# EasyEDA schematic SCH_CarAccessoryKitV1.0.json
TITLE: Car Accessory Kit; REV: 1.0; Date: 2024-07-22; Sheet: 1/1; Drawn By: williammarktaylor; Company: WMTaylor
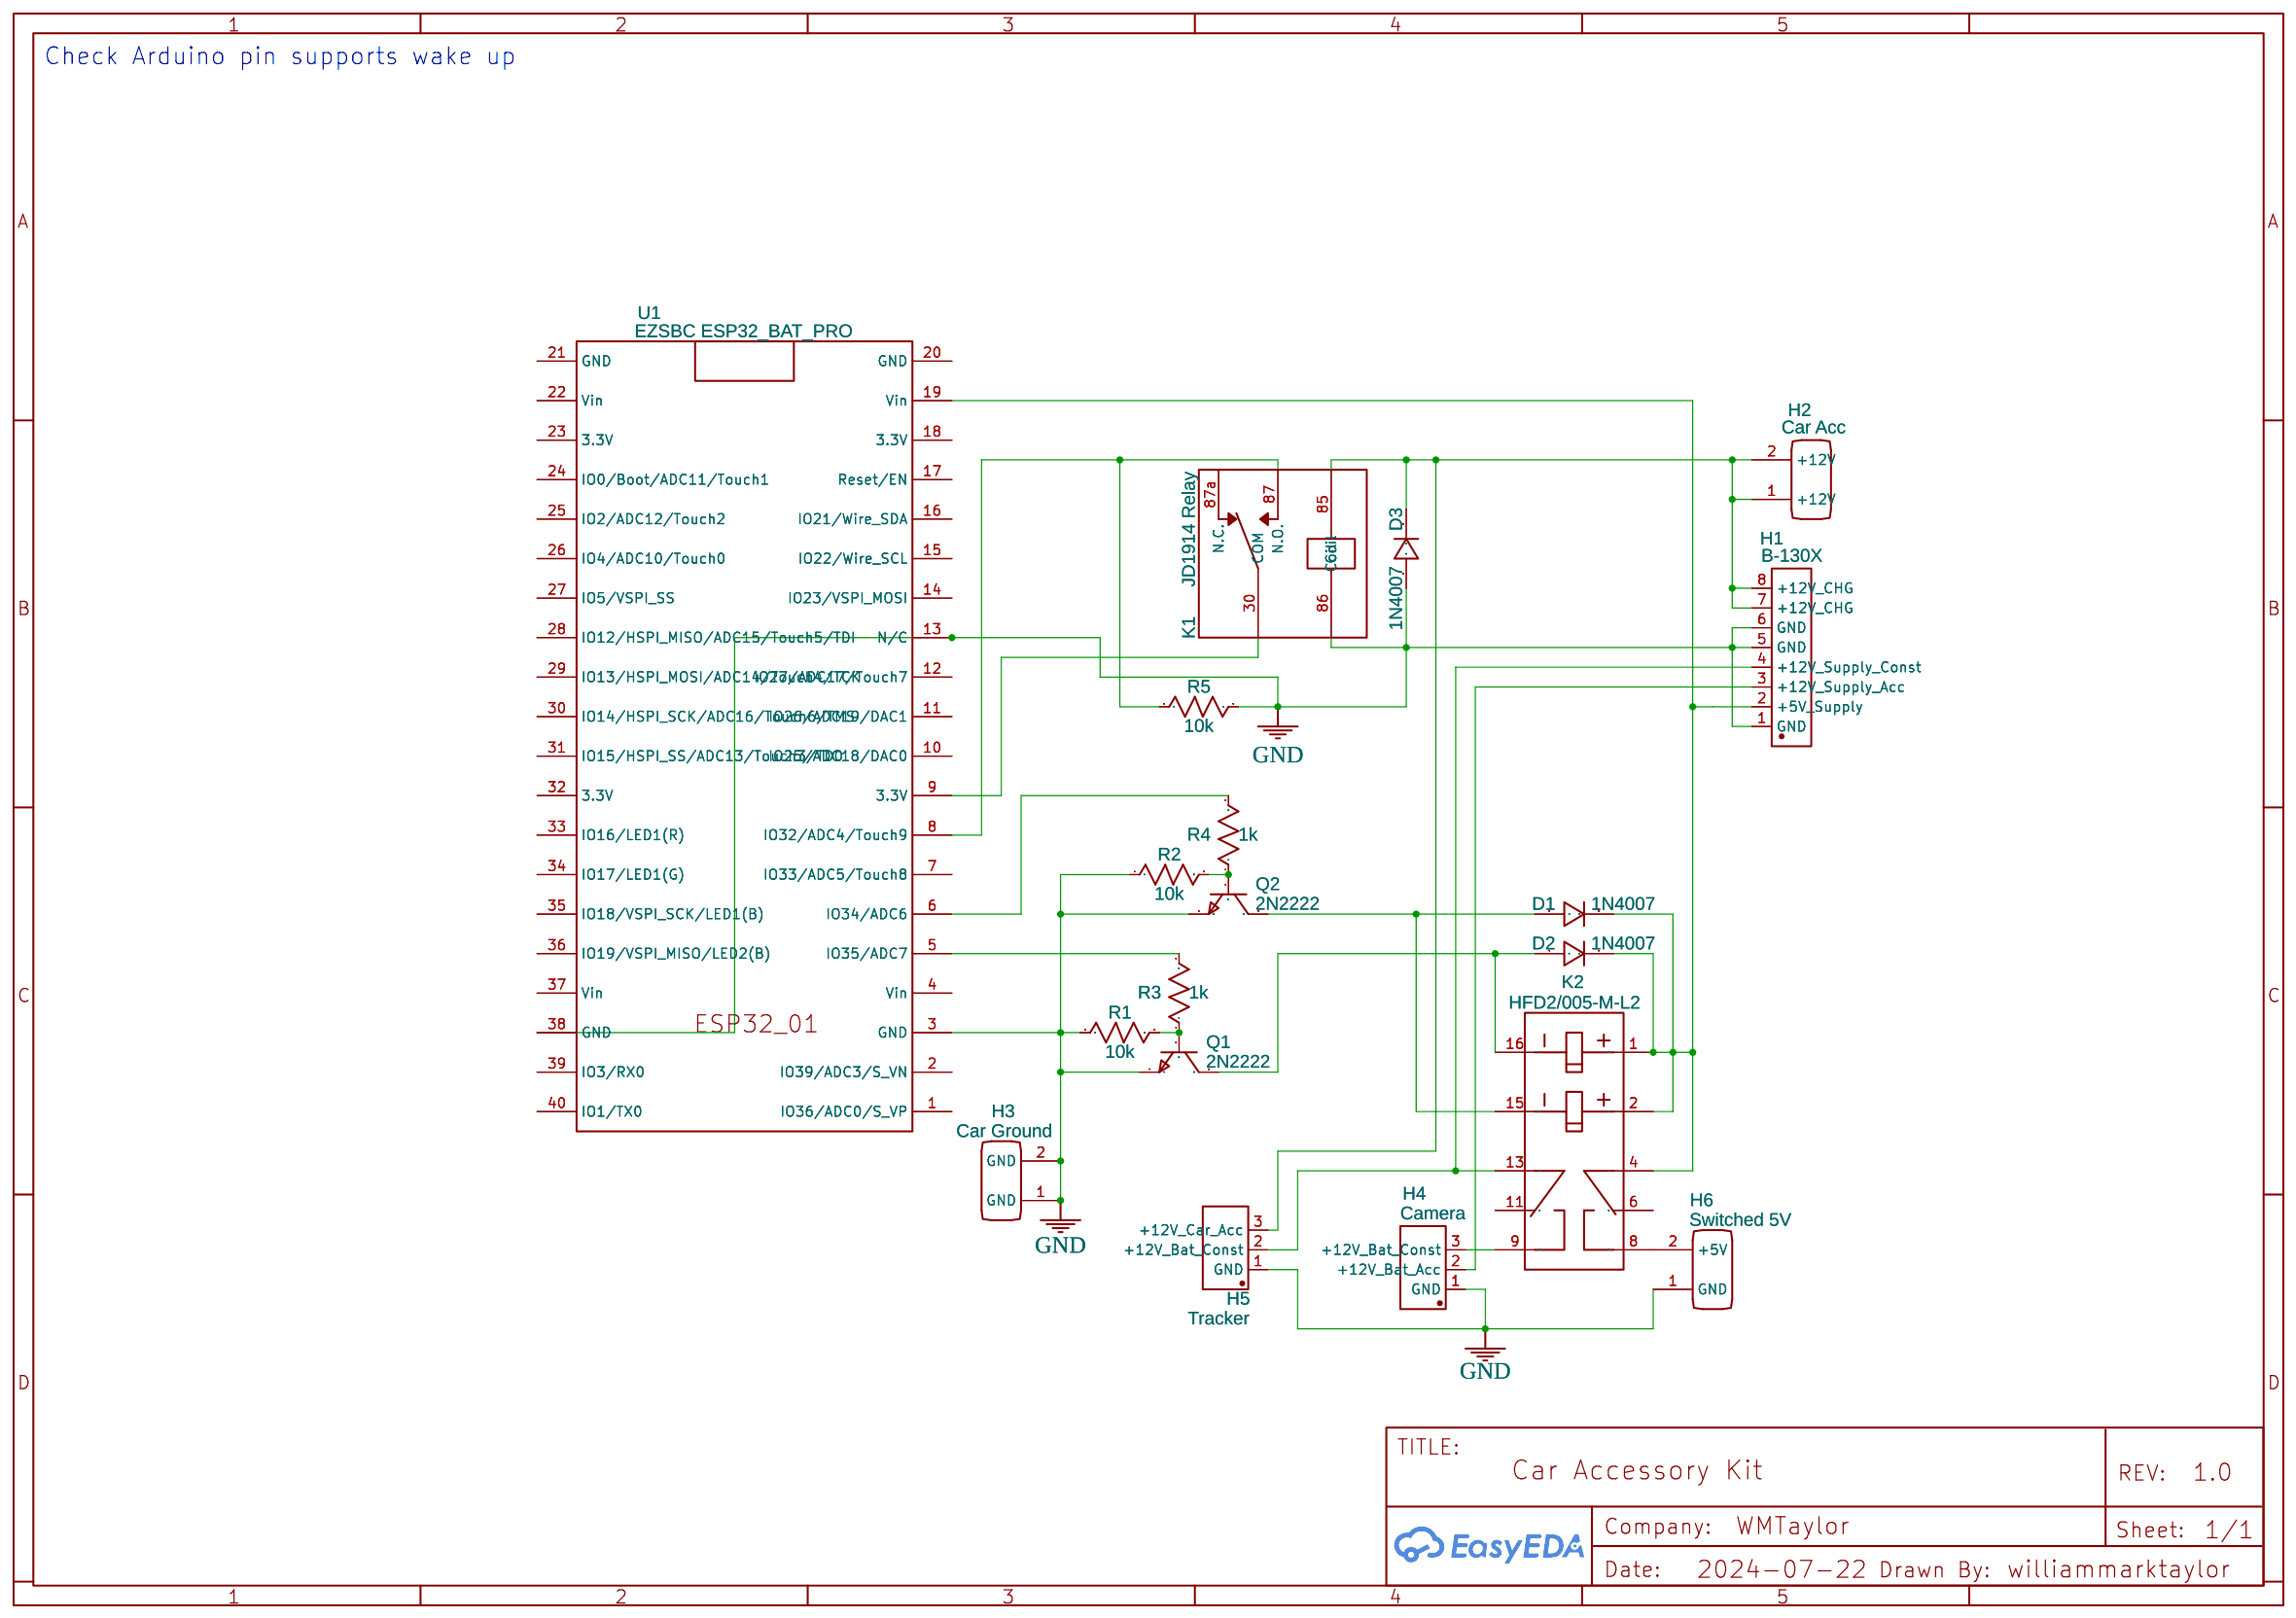
[diagram p0: schematic sheet]

## Parts
D1  1N4007  [DO-41_BD2.4-L4.7-P8.70-D0.9-RD]
D2  1N4007  [DO-41_BD2.4-L4.7-P8.70-D0.9-RD]
D3  1N4007  [DO-41_BD2.4-L4.7-P8.70-D0.9-RD]
H1  B-130X  [CONN-TH_8P-P3.96_CH3.96-8A]
H2  Car Acc  [JST_VH-2P-3.96]
H3  Car Ground  [JST_VH-2P-3.96]
H4  Camera  [CONN-TH_3P-P3.96_VH3.96-3A]
H5  Tracker  [CONN-TH_3P-P3.96_VH3.96-3A]
H6  Switched 5V  [JST_VH-2P-3.96]
K1  JD1914 Relay  [JD1914]
K2  HFD2/005-M-L2  [RELAY-TH_HFD2-X-X-L2-X]
Q1  2N2222  [2N2222]
Q2  2N2222  [2N2222]
R1  10k  [R_AXIAL-0.3]
R2  10k  [R_AXIAL-0.3]
R3  1k  [R_AXIAL-0.3]
R4  1k  [R_AXIAL-0.3]
R5  10k  [R_AXIAL-0.3]
U1  EZSBC ESP32_BAT_PRO  [EZSBC ESP32_01]

## Library data of the parts
D1-D3 = 1N4007: Supplier: LCSC; Manufacturer: SEMTECH; Supplier Part: C106903; Contributor: LCEDA_Lib
H1 = CH3.96-8A: Supplier: LCSC; Manufacturer: BOOMELE; Supplier Part: C10383; JLCPCB Part Class: Extended Part
H2 H3 H6 = JST_VH-2P-3.96: Supplier: LOCAL; Contributor: sanariyarajesh1981
H4 H5 = VH3.96-3A: Supplier: LCSC; Manufacturer: BOOMELE(博穆精密); Manufacturer Part: VH-3A; Supplier Part: C20547; JLCPCB Part Class: Extended Part
K1 = RELAY JD1914 12V 80A: Manufacturer: BenFeng; Supplier: Aliexpress; link: http://www.msrelay.com/Auto_Relay/118.html; Contributor: thien1900
K2 = HFD2/005-M-L2: Contributor: williammarktaylor; Supplier: LCSC; Supplier Part: C399485; Manufacturer: HF(宏发); JLCPCB Part Class: Extended Part
Q1 Q2 = 2N2222: Supplier: ALIEXPRESS; Contributor: BenjaminL
R1-R5 = R_AXIAL-0.3_US: Contributor: LCEDA_Lib
U1 = EZSBC ESP32_01: Manufacturer: EZSBC; Manufacturer Part: ESP32_01; Supplier Part: ESP32_01; Contributor: brad.lotsberg

## Nets
GND: D3.2 H1.1(GND) H1.5(GND) H1.6(GND) H3.1(GND) H3.2(GND) H4.1(GND) H5.1(GND) H6.1(GND) K1.86(Coil) Q1.1(E) Q2.1(E) R1.1 R2.1 R5.2 U1.3(GND) U1.13(N/C) U1.38(GND)
Net-(D1-1): D1.1 D2.1 H1.2(+5V Supply) K2.1 K2.2 K2.4 U1.19(Vin)
Net-(D1-2): D1.2 K2.15 Q2.3(C)
Net-(D2-2): D2.2 K2.16 Q1.3(C)
Net-(D3-1): D3.1 H1.7(+12V CHG) H1.8(+12V CHG) H2.1(+12V) H2.2(+12V) H5.3(+12V Car Acc) K1.85(Coil)
Net-(H1-3): H1.3(+12V Supply Acc) H4.2(+12V Bat Acc)
Net-(H1-4): H1.4(+12V Supply Const) H5.2(+12V Bat Const) K2.13
Net-(H4-3): H4.3(+12V Bat Const) K2.9
Net-(H6-2): H6.2(+5V) K2.8
Net-(K1-30): K1.30(COM) U1.9(3.3V)
Net-(K1-87): K1.87(N.O.) R5.1 U1.8(IO32/ADC4/Touch9)
Net-(Q1-2): Q1.2(B) R1.2 R3.1
Net-(Q2-2): Q2.2(B) R2.2 R4.1
Net-(R3-2): R3.2 U1.5(IO35/ADC7)
Net-(R4-2): R4.2 U1.6(IO34/ADC6)

Not connected (* = marked no-connect by the designer): K1 87a(N.C.); K2 6 11; U1 1(IO36/ADC0/S_VP) 2(IO39/ADC3/S_VN) 4(Vin) 7(IO33/ADC5/Touch8) 10(IO25/ADC18/DAC0) 11(IO26/ADC19/DAC1) 12(IO27/ADC17/Touch7) 14(IO23/VSPI MOSI) 15(IO22/Wire SCL) 16(IO21/Wire SDA) 17(Reset/EN) 18(3.3V) 20(GND) 21(GND) 22(Vin) 23(3.3V) 24(IO0/Boot/ADC11/Touch1) 25(IO2/ADC12/Touch2) 26(IO4/ADC10/Touch0) 27(IO5/VSPI SS) 28(IO12/HSPI MISO/ADC15/Touch5/TDI) 29(IO13/HSPI MOSI/ADC14/Touch4/TCK) 30(IO14/HSPI SCK/ADC16/Touch6/TMS) 31(IO15/HSPI SS/ADC13/Touch3/TD0) 32(3.3V) 33(IO16/LED1(R)) 34(IO17/LED1(G)) 35(IO18/VSPI SCK/LED1(B)) 36(IO19/VSPI MISO/LED2(B)) 37(Vin) 39(IO3/RX0) 40(IO1/TX0)

## Notes on the sheet
- Check Arduino pin supports wake up
